# Altium schematic sheet LCDTFT_RTP_DRV_XPT2046.SchDoc
size A3; SheetNumber: 22; SheetTotal: 22
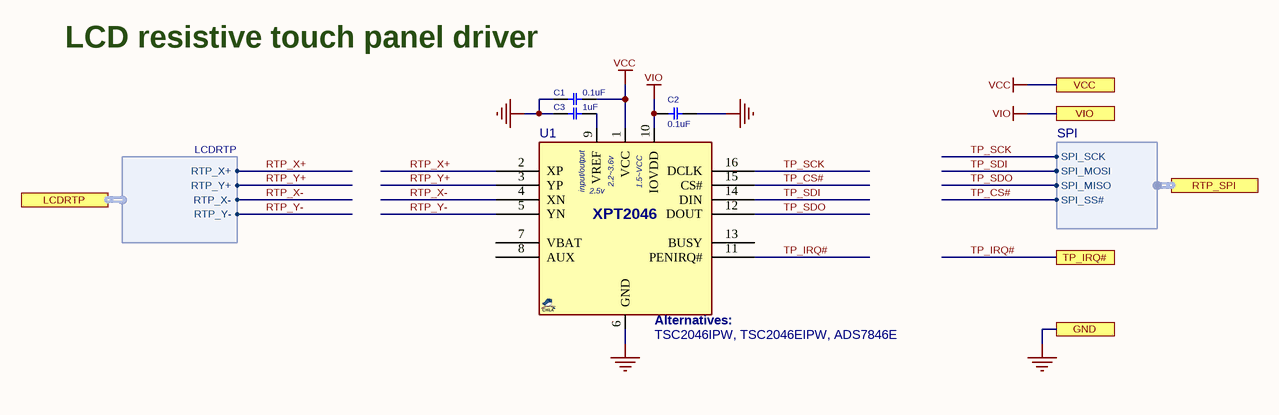
[diagram p0: LCDTFT_RTP_DRV_XPT2046.SchDoc]

## Parts
C1  0.1uF  [C0402]
C2  0.1uF  [C0402]
C3  1uF  [C0402]
U1  XPT2046  [SOG65_16]  (value not drawn)

## Ports
GND, LCDRTP (harness LCDRTP), RTP_SPI (harness SPI), TP_IRQ#, VCC, VIO

## Harnesses
LCDRTP: RTP_X+, RTP_Y+, RTP_X-, RTP_Y-
SPI: SPI_SCK, SPI_MOSI, SPI_MISO, SPI_SS#

## Nets
GND: C1.2 C2.1 C3.2 U1.6(GND) ; port GND
VCC: C1.1 U1.1(VCC) ; port VCC
VIO: C2.2 U1.10(IOVDD) ; port VIO
RTP_X+: U1.2(XP) ; port LCDRTP.RTP_X+
RTP_X-: U1.4(XN) ; port LCDRTP.RTP_X-
RTP_Y+: U1.3(YP) ; port LCDRTP.RTP_Y+
RTP_Y-: U1.5(YN) ; port LCDRTP.RTP_Y-
TP_CS#: U1.15(CS#) ; port RTP_SPI.SPI_SS#
TP_IRQ#: U1.11(PENIRQ#) ; port TP_IRQ#
TP_SCK: U1.16(DCLK) ; port RTP_SPI.SPI_SCK
TP_SDI: U1.14(DIN) ; port RTP_SPI.SPI_MOSI
TP_SDO: U1.12(DOUT) ; port RTP_SPI.SPI_MISO
NetC3_1: C3.1 U1.9(VREF)

Not connected (* = marked no-connect by the designer): U1 7(VBAT) 8(AUX) 13(BUSY)

## Notes on the sheet
- LCD resistive touch panel driver
- (near U1) Alternatives:
- (near U1) TSC2046IPW, TSC2046EIPW, ADS7846E
- (in symbol XPT2046_TSSOP16) input/output; 2.2~3.6v; 1.5~VCC; 2.5v

## Library data of the parts
C1 C2 = CAP_SMD_MLCC: CAP, MLCC; PARAM: X7R, 10%, -55~125oC; MANF_P#: GRM155R71H104KE14D; MANF: Murata; PARAM2: 50v; PRICE: 100: 0.018$; ASSEMBLY: ASSEMBLY; VALUE: 0.1uF
C3 = CAP_SMD_MLCC: CAP, MLCC; PARAM: X5R, 10%; MANF_P#: CL05A105KO5NNND; MANF: Samsung; PARAM2: 16v; PRICE: 50,000:	$0.006; ASSEMBLY: ASSEMBLY; VALUE: 1uF
U1 = XPT2046_TSSOP16: LCD, Touch screen controller, resistive, 4-wire; MANF: XPT; PARAM2: 2.2~3.6VCC, VIO: 1.5~VCC; PARAM: 12Bit, 125KHz; MANF_P#: XPT2046; PRICE: 0.4$; VALUE: XPT2046